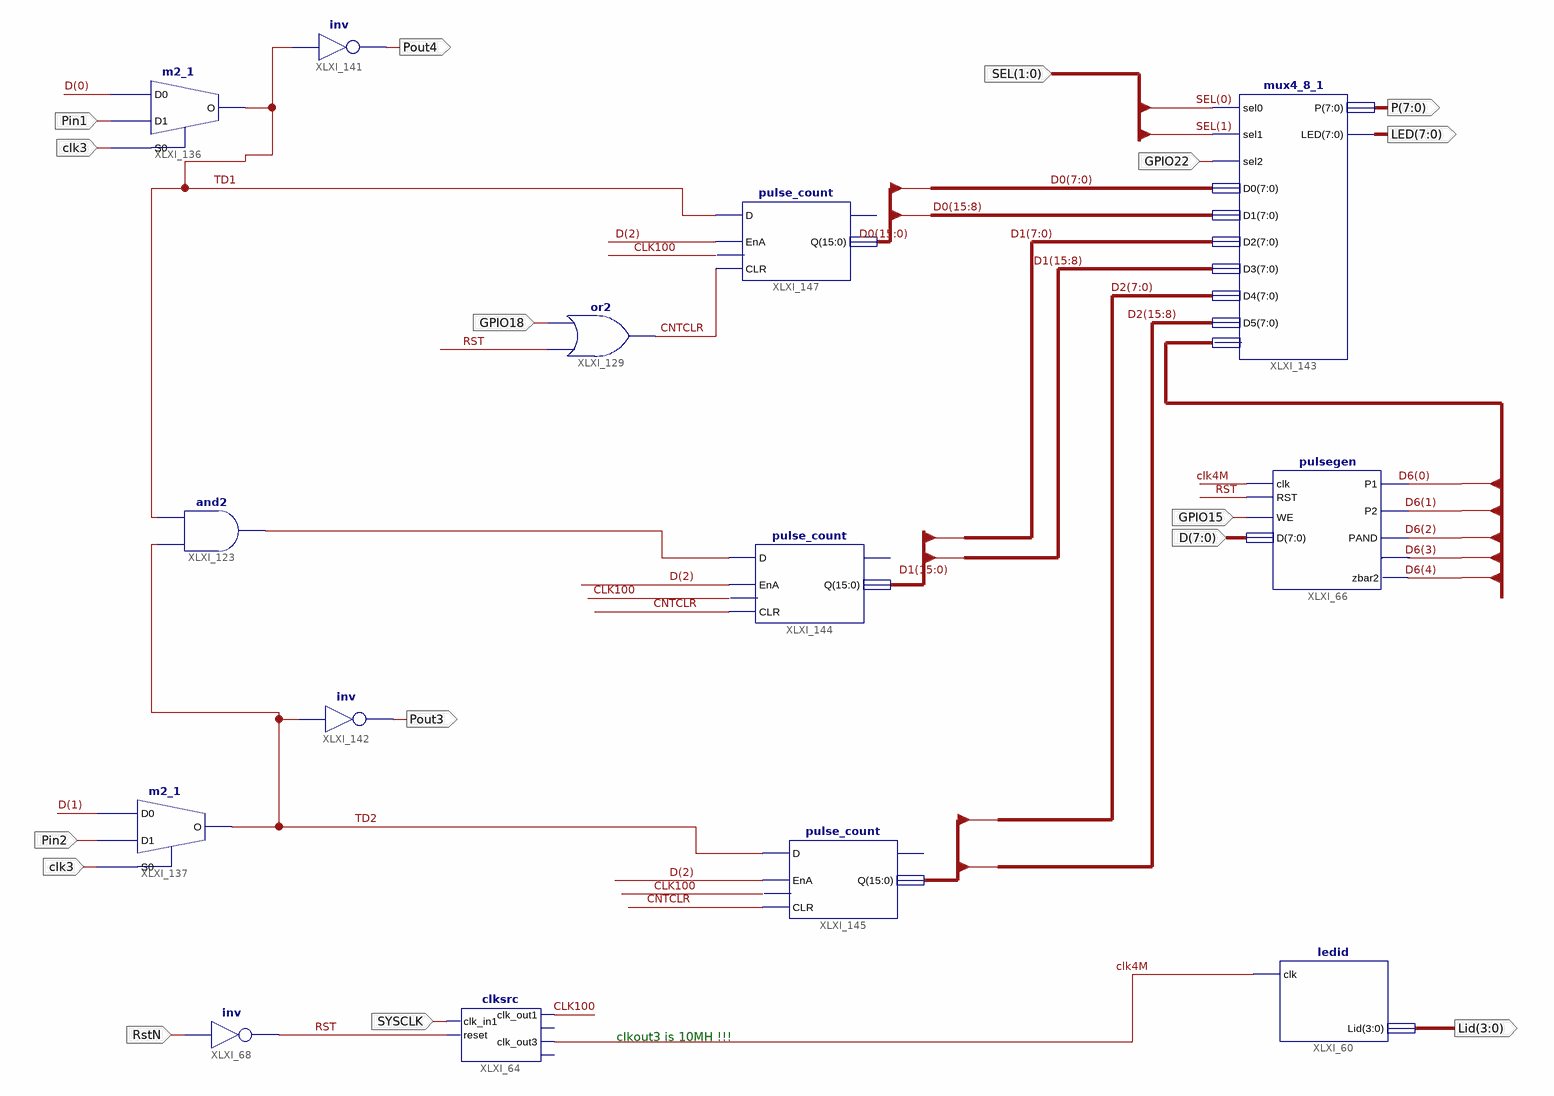
[diagram p0: schematic sheet 1]
// Xilinx ISE schematic digpr2top.sch (spartan6) as structural Verilog: 14 symbols, 15 ports
module digpr2top (
  input  GPIO22,
  input  RstN,
  input  [7:0] D,
  input  GPIO15,
  input  SYSCLK,
  input  [1:0] SEL,
  input  Pin1,
  input  Pin2,
  input  GPIO18,
  input  clk3,
  output [7:0] P,
  output [7:0] LED,
  output [3:0] Lid,
  output Pout3,
  output Pout4
);

  wire clk4M, CLK100, CNTCLR, RST, TD1, TD2, XLXN_358;
  wire [7:0] D6;
  wire [15:0] D0, D1, D2;

  ledid XLXI_60 (.clk(clk4M), .Lid(Lid));
  not XLXI_68 (RST, RstN);
  and XLXI_123 (XLXN_358, TD2, TD1);
  pulsegen XLXI_66 (
    .clk(clk4M), .D(D), .P1(D6[0]), .P2(D6[1]), .PAND(D6[2]), .RST(RST), .WE(GPIO15), .zbar1(D6[3]),
    .zbar2(D6[4]));
  clksrc XLXI_64 (.clk_in1(SYSCLK), .reset(RST), .clk_out1(CLK100), .clk_out3(clk4M));  // open: clk_out2, locked
  or XLXI_129 (CNTCLR, RST, GPIO18);
  m2_1 XLXI_136 (.D0(D[0]), .D1(Pin1), .S0(clk3), .O(TD1));
  m2_1 XLXI_137 (.D0(D[1]), .D1(Pin2), .S0(clk3), .O(TD2));
  not XLXI_141 (Pout4, TD1);
  not XLXI_142 (Pout3, TD2);
  mux4_8_1 XLXI_143 (
    .sel0(SEL[0]), .sel1(SEL[1]), .sel2(GPIO22), .D0(D0[7:0]), .D1(D0[15:8]), .D2(D1[7:0]), .D3(D1[15:8]),
    .D4(D2[7:0]), .D5(D2[15:8]), .P(P), .LED(LED), .D6(D6));
  pulse_count XLXI_144 (.D(XLXN_358), .EnA(D[2]), .CLR(CNTCLR), .CLK(CLK100), .Q(D1));  // open: CNTE_out
  pulse_count XLXI_145 (.D(TD2), .EnA(D[2]), .CLR(CNTCLR), .CLK(CLK100), .Q(D2));  // open: CNTE_out
  pulse_count XLXI_147 (.D(TD1), .EnA(D[2]), .CLR(CNTCLR), .CLK(CLK100), .Q(D0));  // open: CNTE_out

  // Notes on the sheet:
  //   clkout3 is 10MH !!!
endmodule
